# EAGLE design attiny_cool (EAGLE 6.5.0)
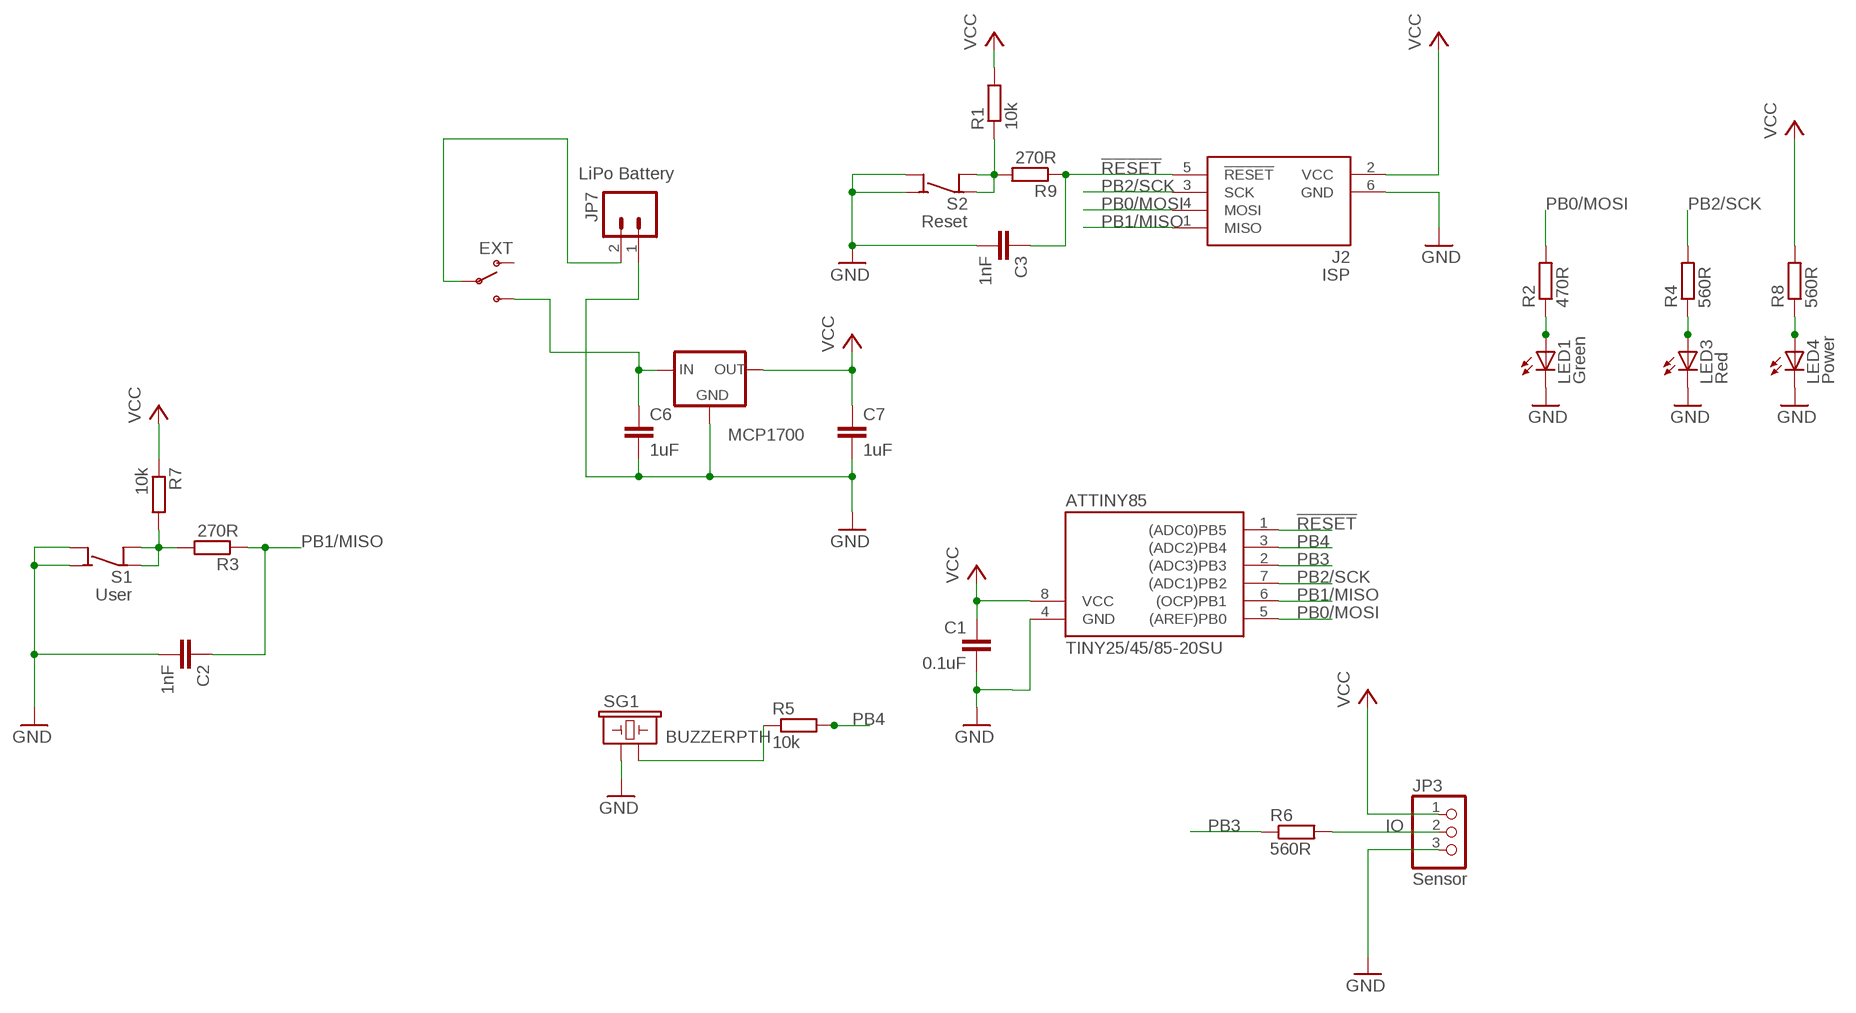
[diagram p0: schematic, sheet 1]

## Parts
ATTINY85  TINY25/45/85-20SU  [SOIC8]
C1  0.1uF  C-EUC0805  [C0805]
C2  1nF  C-EUC0805  [C0805]
C3  1nF  C-EUC0805  [C0805]
C6  1uF  C-EUC0805  [C0805]
C7  1uF  C-EUC0805  [C0805]
J2  ISP  AVRISP6  [CON6P2R]
JP3  Sensor  PINHD-1X3  [1X03]
JP7  LiPo Battery  M02JST-PTH-2  [JST-2-PTH]
LED1  Green  LEDCHIPLED_1206  [CHIPLED_1206]
LED3  Red  LEDCHIPLED_1206  [CHIPLED_1206]
LED4  Power  LEDCHIPLED_1206  [CHIPLED_1206]
MCP1700  MCP1700  MCP1700SOT-23  [SOT-23]
ON  EXT  SWITCH-SPSTPTH  [SWITCH-SPDT]
R1  10k  R-EU_R0805  [R0805]
R2  470R  R-EU_R0805  [R0805]
R3  270R  R-EU_R0805  [R0805]
R4  560R  R-EU_R0805  [R0805]
R5  10k  R-EU_R0805  [R0805]
R6  560R  R-EU_R0805  [R0805]
R7  10k  R-EU_R0805  [R0805]
R8  560R  R-EU_R0805  [R0805]
R9  270R  R-EU_R0805  [R0805]
S1  User  SPST4  [6MMTACTILE_4PIN]
S2  Reset  SPST4  [6MMTACTILE_4PIN]
SG1  BUZZERPTH  [BUZZER-12MM]

## Nets
!RESET: ATTINY85.1((ADC0)PB5) C3.1 J2.5(!RESET) R9.1
GND [GND]: ATTINY85.4(GND) C1.2 C2.2 C3.2 C6.2 C7.2 J2.6(GND) JP3.3 JP7.1 LED1.C LED3.C LED4.C MCP1700.1(GND) S1.A1(NO) S1.A2(NO) S2.A1(NO) S2.A2(NO) SG1.+
IO: JP3.2 R6.2
N$1: LED3.A R4.1
N$2: LED4.A R8.1
N$3 [VCC]: JP7.2 ON.2(P)
N$4: LED1.A R2.1
N$5: R3.2 R7.2 S1.B1(COM) S1.B2(COM)
N$6: R5.1 SG1.-
N$7: R1.1 R9.2 S2.B1(COM) S2.B2(COM)
N$15 [VCC]: C6.1 MCP1700.3(IN) ON.3(S)
PB0/MOSI: ATTINY85.5((AREF)PB0) J2.4(MOSI) R2.2
PB1/MISO: ATTINY85.6((OCP)PB1) C2.1 J2.1(MISO) R3.1
PB2/SCK: ATTINY85.7((ADC1)PB2) J2.3(SCK) R4.2
PB3: ATTINY85.2((ADC3)PB3) R6.1
PB4: ATTINY85.3((ADC2)PB4) R5.2
VCC [VCC]: ATTINY85.8(VCC) C1.1 C7.1 J2.2(VCC) JP3.1 MCP1700.2(OUT) R1.2 R7.1 R8.2
Unconnected: ON.1(O)

## Library data of the parts
ATTINY85 = avr-7:TINY25/45/85
C1-C3 C6 C7 = resistor:C-EU: CAPACITOR, European symbol
J2 = ads4:AVRISP6: 6-pin dual-row connector for Atmel AVRISP programmer interface
JP3 = pinhead:PINHD-1X3: PIN HEADER
JP7 = SparkFun:M02: Header 2 Standard 2-pin 0.1" header. Use with straight break away headers (SKU : PRT-00116), right angle break away headers (PRT-00553), swiss pins (PRT-00743), machine pins (PRT-00117), and female headers (PRT-00115). Molex polarized connector foot print use with SKU : PRT-08233 with associated crimp pins and housings.
LED1 LED3 LED4 = adafruit:LED: LED OSRAM: - CHIPLED LG R971, LG N971, LY N971, LG Q971, LY Q971, LO R971, LY R971 LH N974, LH R974 LS Q976, LO Q976, LY Q976 LO Q996 - Hyper CHIPLED LW Q18S LB Q993, LB Q99A, LB R99A - SideLED LS A670, LO A670, LY A670, LG A670, LP A670 LB A673, LV A673, LT A673, LW A673 LH A674 LY A675 LS A676, LA A676, LO A676, LY A676, LW A676 LS A679, LY A679, LG A679 - Hyper Micro SIDELED® LS Y876, LA Y876, LO Y876, LY Y876 LT Y87S - SmartLED LW L88C, LW L88S LB L89C, LB L89S, LG L890 LS L89K, LO L89K, LY L89K LS L896, LA L896, LO L896, LY L896 - TOPLED LS T670, LO T670, LY T670, LG T670, LP T670 LSG T670, LSP T670, LSY T670, LOP T670, LYG T670 LG T671, LOG T671, LSG T671 LB T673, LV T673, LT T673, LW T673 LH T674 LS T676, LA T676, LO T676, LY T676, LB T676, LH T676, LSB T676, LW T676 LB T67C, LV T67C, LT T67C, LS T67K, LO T67K, LY T67K, LW E67C LS E67B, LA E67B, LO E67B, LY E67B, LB E67C, LV E67C, LT E67C LW T67C LS T679, LY T679, LG T679 LS T770, LO T770, LY T770, LG T770, LP T770 LB T773, LV T773, LT T773, LW T773 LH T774 LS E675, LA E675, LY E675, LS T675 LS T776, LA T776, LO T776, LY T776, LB T776 LHGB T686 LT T68C, LB T68C - Hyper Mini TOPLED® LB M676 - Mini TOPLED Santana® LG M470 LS M47K, LO M47K, LY M47K Source: http://www.osram.convergy.de/
MCP1700 = MY_IC:MCP1700
ON = SparkFun:SWITCH-SPST: SPST Switch Simple slide switch. Spark Fun Electronics SKU : COM-00102
R1-R9 = resistor:R-EU_: RESISTOR, European symbol
S1 S2 = mes_electromech:SPST4: SPST switch with 2 pins per contact
SG1 = SparkFun:BUZZER: Buzzer 12mm Spark Fun Electronics SKU : Comp-Buzzer

## Net classes
0 default: width 0.305 mm, drill 0.508 mm
1 GND: width 0.508 mm, drill 0.508 mm
2 VCC: width 0.508 mm

## Board
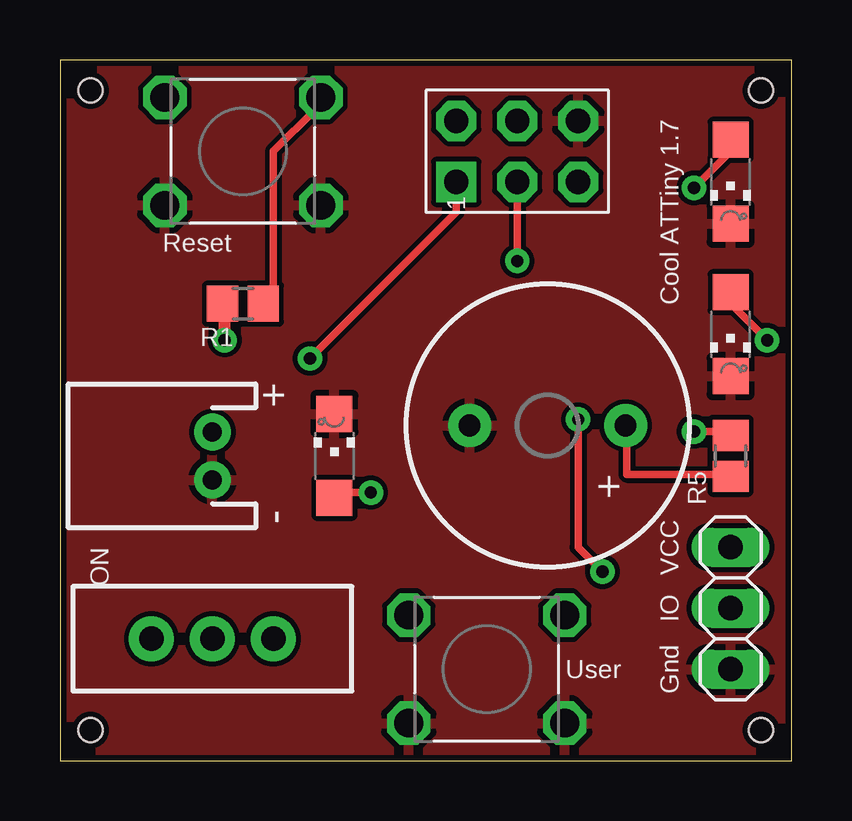
[diagram p1: board, top side]
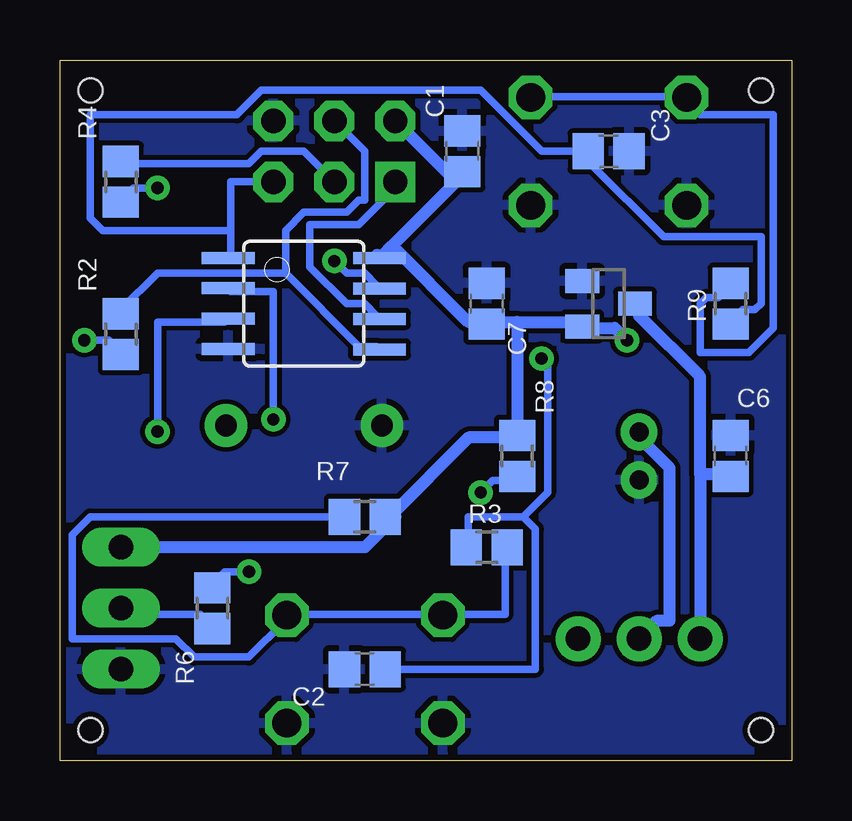
[diagram p2: board, bottom side, seen from below]

Size 30.48 x 29.21 mm. Coordinates in mm from the lower left corner, seen from the top.
Outline: 0,0 30.48,0 30.48,29.21 0,29.21 0,0
Copper layers (1*16): Top 0.035mm / dielectric 1.5mm / Bottom 0.035mm
Design rules "SparkFun *": minimum track width 12mil, minimum drill 20mil, track to track 8mil, track to pad 8mil, pad to pad 8mil, via to via 8mil, smd to smd 8mil, copper to edge 10mil, drill to drill 8mil, minimum pad ring 12mil, minimum via ring 10mil, stop-mask expansion 4mil, vias tented up to drill 25mil, thermal gap 10mil
Holes 1 mm at 1.27,1.27 1.27,27.94 29.21,1.27 29.21,27.94

### Footprints (pad centres in the part's own frame; a part is rotated, then mirrored left to right if it is on the bottom)
SOIC8 = smd 0.5 x 2.2: 1 -1.905,-3.154; 2 -0.645,-3.154; 3 0.625,-3.154; 4 1.895,-3.154; 5 1.905,3.154; 6 0.635,3.154; 7 -0.635,3.154; 8 -1.905,3.154
C0805 = smd 1.3 x 1.5: 1 -0.85,0; 2 0.85,0
CON6P2R = drill 1.016 pad 1.676 square: 1 -2.54,-1.27 | drill 1.016 pad 1.676 octagon: 2 -2.54,1.27; 3 0,-1.27; 4 0,1.27; 5 2.54,-1.27; 6 2.54,1.27
1X03 = drill 1.016 long: 1 -2.54,0; 2 0,0; 3 2.54,0
JST-2-PTH = drill 0.787 pad 1.524: 1 -1,0; 2 1,0
CHIPLED_1206 = smd 1.5 x 1.5: A 0,-1.75; C 0,1.75
SOT-23 = smd 1 x 1.4: 1 -0.95,-1.1; 2 0.95,-1.1; 3 0,1.1
SWITCH-SPDT = drill 1.016 pad 1.88: 1 0,2.54; 2 0,0; 3 0,-2.54
R0805 = smd 1.3 x 1.5: 1 -0.85,0; 2 0.85,0
6MMTACTILE_4PIN = drill 1.2 octagon: A1 3.25,-2.25; A2 -3.25,-2.25; B1 3.25,2.25; B2 -3.25,2.25
BUZZER-12MM = drill 0.9 pad 1.778: + 3.25,0; - -3.25,0

### Placement (x,y rotation side)
ATTINY85  20.32,19.05 270 bottom
C1  13.72,25.4 90 bottom
C2  17.78,3.81 180 bottom
C3  7.62,25.4 0 bottom
C6  2.54,12.7 90 bottom
C7  12.7,19.05 90 bottom
J2  19.05,25.4 0 top
JP3  27.94,6.35 270 top
JP7  6.35,12.7 90 top
LED1  27.94,17.78 180 top
LED3  27.94,24.13 180 top
LED4  11.43,12.7 0 top
MCP1700  7.62,19.05 270 bottom
ON  6.35,5.08 270 top
R1  7.62,19.05 180 top
R2  27.94,17.78 90 bottom
R3  12.7,8.89 0 bottom
R4  27.94,24.13 90 bottom
R5  27.94,12.7 90 top
R6  24.13,6.35 270 bottom
R7  17.78,10.16 180 bottom
R8  11.43,12.7 90 bottom
R9  2.54,19.05 90 bottom
S1  17.78,3.81 0 top
S2  7.62,25.4 0 top
SG1  20.32,13.97 180 top

### Tracks (layer width: path | path; a pad name or v marks a point on that pad's centre or on a via)
!RESET
  Bottom 0.305: 23.37,22.1 23.37,24.13 J2.5 | 23.37,22.1 23.37,21.08 ATTINY85.1 | R9.1 2.54,18.29 2.03,18.8 1.52,18.8 1.27,19.05 1.27,21.84 5.33,21.84 8.38,24.89 8.38,25.4 C3.1 10.41,25.4 12.95,27.94 22.1,27.94 23.11,26.92 29.21,26.92 29.21,22.61 28.7,22.1 23.37,22.1
GND
  pour Bottom: 0,29.21 30.48,29.21 30.48,0 0,0
  pour Top: 0,29.21 30.48,29.21 30.48,0 0,0
IO
  Bottom 0.305: JP3.2 27.69,6.1 24.64,6.1 24.13,5.59 R6.2
N$1  (via drill 0.51)
  Top 0.305: v26.42,23.88 27.94,25.4 LED3.A
  Bottom 0.305: v26.42,23.88 27.43,23.88 27.94,23.37 R4.1
N$2  (via drill 0.51)
  Top 0.305: v12.95,11.18 11.43,11.18 LED4.A
  Bottom 0.305: v12.95,11.18 12.45,11.68 11.43,11.68 R8.1
N$3
  Bottom 0.508: ON.2 5.59,5.84 5.08,5.84 5.08,12.19 6.35,13.46 JP7.2
N$4  (via drill 0.51)
  Top 0.305: v29.46,17.53 27.94,19.05 LED1.A
  Bottom 0.305: v29.46,17.53 28.45,17.53 27.94,17.02 R2.1
N$5
  Bottom 0.305: R3.2 11.94,8.89 11.94,6.1 14.48,6.1 S1.B2 14.73,6.1 20.83,6.1 S1.B1 21.08,5.84 22.61,4.32 24.89,4.32 25.65,5.08 29.97,5.08 29.97,9.4 29.21,10.16 R7.2
N$6
  Top 0.305: R5.1 27.94,11.94 23.62,11.94 23.62,13.97 SG1.-
N$7
  Top 0.305: R1.1 8.64,19.05 8.89,19.3 8.89,25.4 10.67,27.18 10.67,27.43 S2.B1
  Bottom 0.305: R9.2 2.54,19.81 3.05,19.3 3.56,19.3 3.81,19.05 3.81,17.02 1.78,17.02 0.76,18.03 0.76,26.92 3.81,26.92 4.32,27.43 S2.B2 4.57,27.69 10.67,27.69 S2.B1
N$15
  Bottom 0.508: 3.81,11.94 3.81,16 6.35,18.54 6.35,19.05 MCP1700.3 | 3.81,11.94 2.54,11.94 C6.1 | 3.81,11.94 ON.3
PB0/MOSI
  Bottom 0.305: 21.08,20.32 26.42,20.32 27.94,18.8 R2.2 | 21.08,20.32 18.03,17.27 17.27,17.27 ATTINY85.5 | J2.4 17.78,25.4 17.78,23.37 18.03,23.37 18.54,22.86 20.32,22.86 21.08,22.1 21.08,20.32
PB1/MISO  (via drill 0.51)
  Top 0.305: v10.41,16.76 16.51,22.86 J2.1
  Bottom 0.305: 11.18,10.16 13.46,10.16 13.46,8.89 R3.1 | 11.18,10.16 10.67,9.65 10.67,3.81 C2.1 | J2.1 16.51,23.88 18.03,22.35 20.07,22.35 20.07,20.57 18.54,19.05 17.78,19.05 17.27,18.54 ATTINY85.6 | 11.18,10.16 10.16,11.18 10.16,16.76 v10.41,16.76
PB2/SCK  (via drill 0.51)
  Top 0.305: J2.3 v19.05,20.83
  Bottom 0.305: J2.3 20.32,25.4 22.1,25.4 22.61,24.89 27.94,24.89 R4.2 | v19.05,20.83 18.54,20.32 17.78,20.32 17.27,19.81 ATTINY85.7
PB3  (via drill 0.51)
  Top 0.305: v22.61,7.87 21.59,8.89 v21.59,14.22
  Bottom 0.305: v22.61,7.87 23.62,7.87 24.13,7.37 R6.1 | v21.59,14.22 21.59,19.56 23.37,19.56 ATTINY85.2
PB4  (via drill 0.51)
  Top 0.305: v26.42,13.72 27.94,13.72 R5.2
  Bottom 0.305: v26.42,13.72 26.42,18.29 23.62,18.29 ATTINY85.3
VCC  (via drill 0.51)
  Top 0.508: v6.86,17.53 6.86,19.05 R1.2
  Bottom 0.508: 16.64,21.46 17.02,21.08 ATTINY85.8 17.27,21.08 | 16.64,21.46 13.72,24.38 C1.1 13.97,24.38 14.22,24.38 J2.2 | 12.7,18.29 11.43,18.29 | 11.43,18.29 8.89,18.29 MCP1700.2 8.64,18.03 7.37,18.03 v6.86,17.53 | 11.43,18.29 R8.2 11.43,13.46 13.46,13.46 16.76,10.16 R7.1 16.51,10.16 17.78,8.89 JP3.1 | 16.64,21.46 13.46,18.29 12.7,18.29 | 12.7,18.29 C7.1

### Text on the board
tNames: 1 | Cool ATTiny 1.7 | + | + | - | VCC | IO | Gnd